# EAGLE design usb2ax_pro_main_v1.0 (EAGLE 7.6.0)
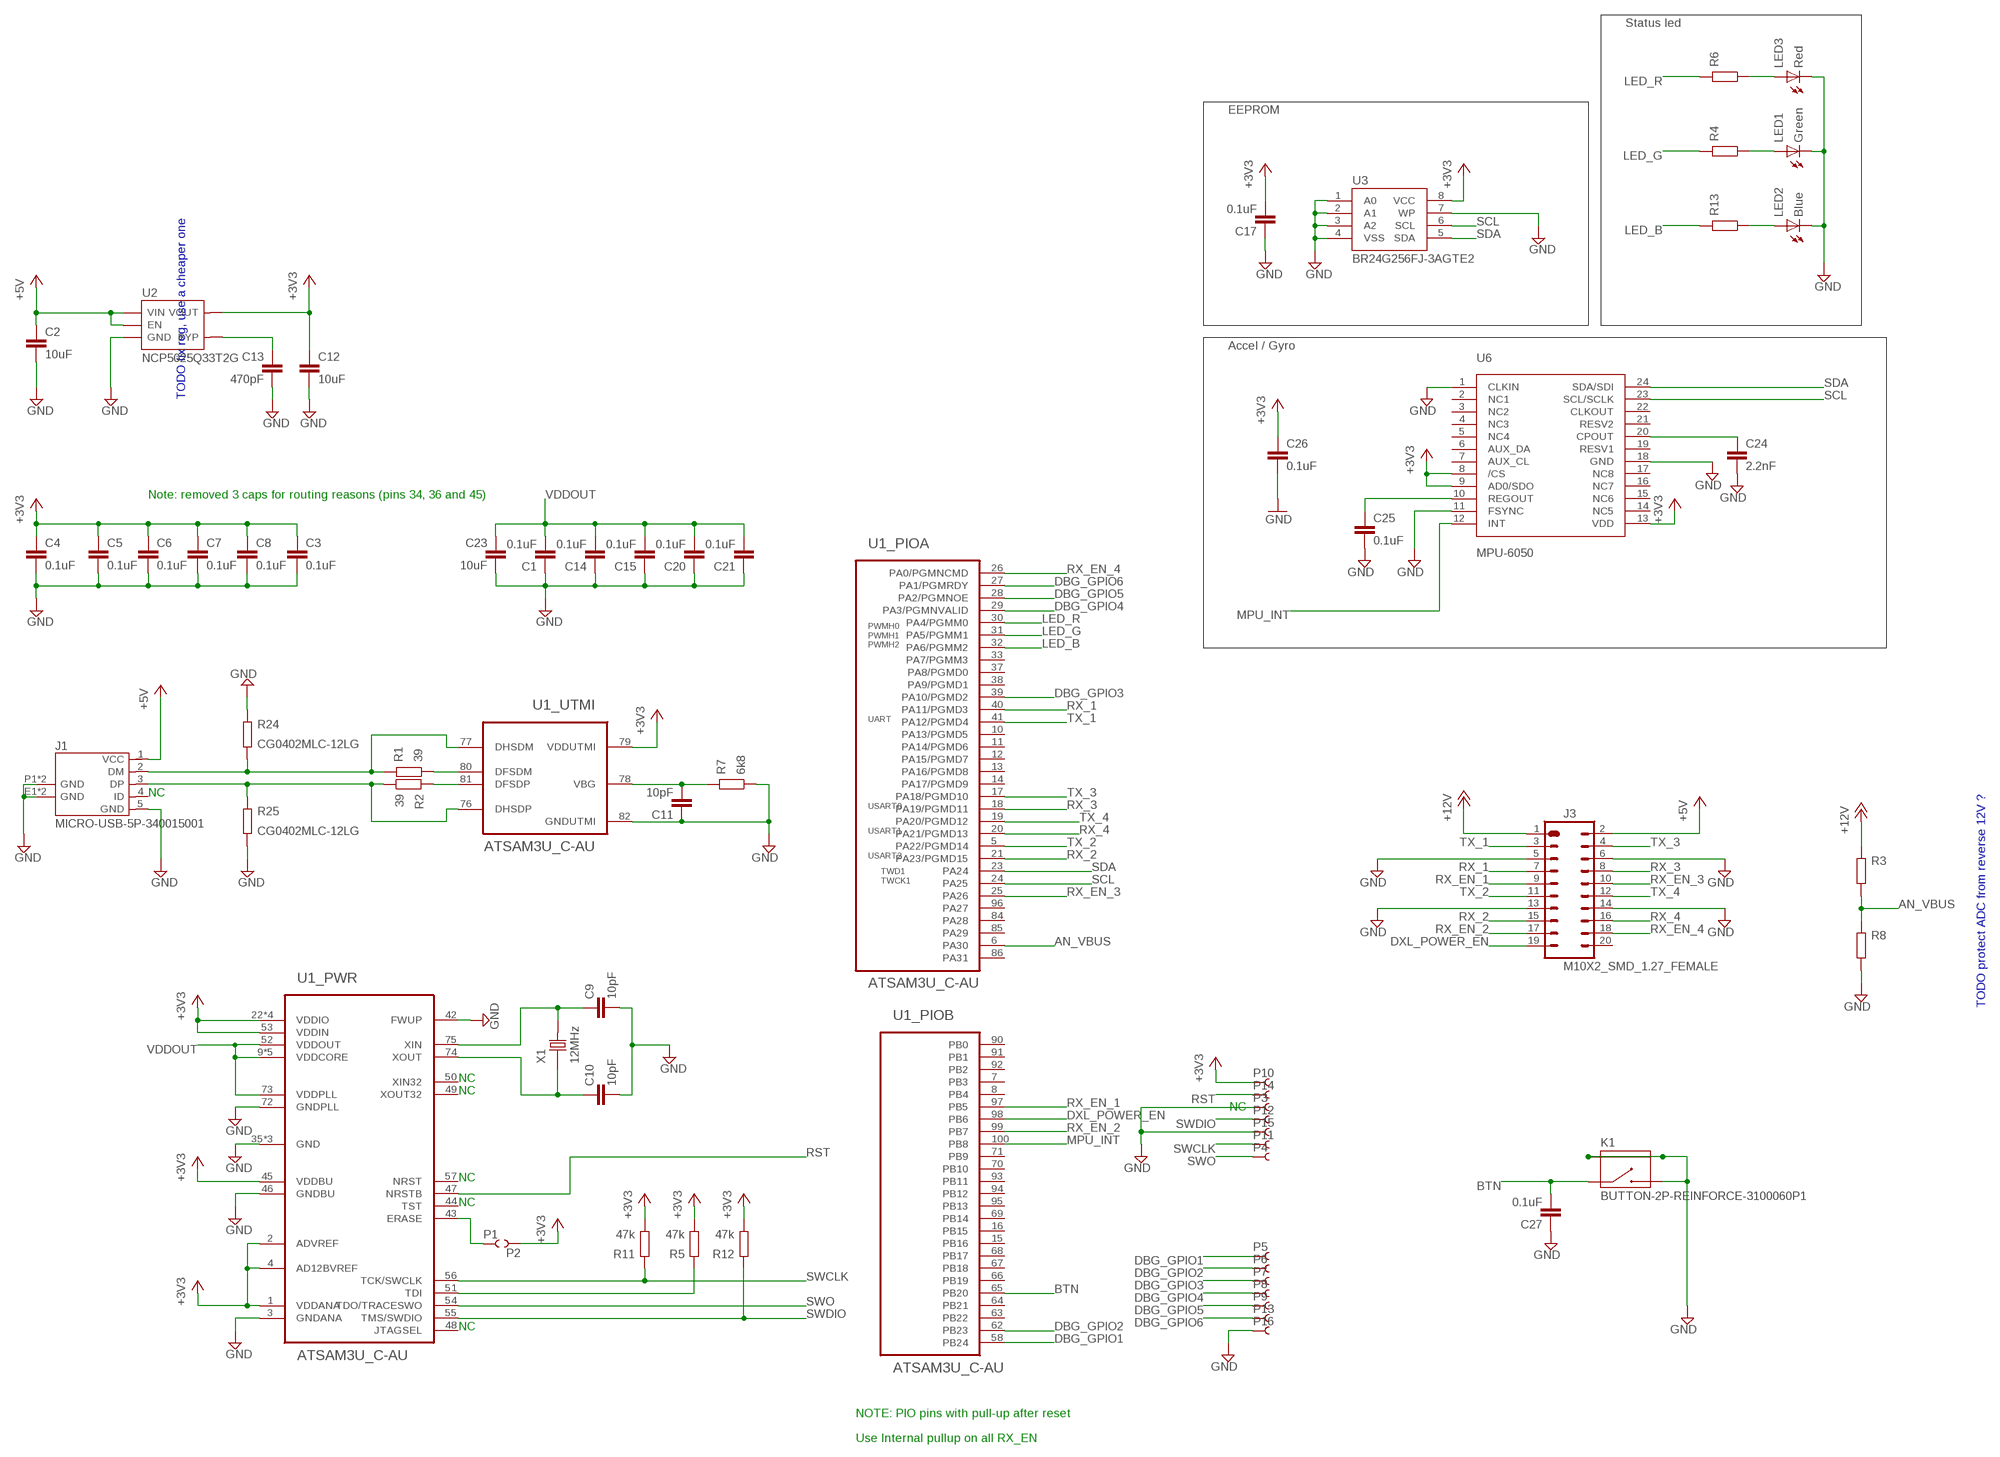
[diagram p0: schematic, sheet 1]

## Parts
C1  0.1uF  C0201  [0201_N]
C2  10uF  C0805  [0805_N]
C3  0.1uF  C0201  [0201_N]
C4  0.1uF  C0201  [0201_N]
C5  0.1uF  C0201  [0201_N]
C6  0.1uF  C0201  [0201_N]
C7  0.1uF  C0201  [0201_N]
C8  0.1uF  C0201  [0201_N]
C9  10pF  C0201  [0201_N]
C10  10pF  C0201  [0201_N]
C11  10pF  C0201  [0201_N]
C12  10uF  C0805  [0805_N]
C13  470pF  C0201  [0201_N]
C14  0.1uF  C0201  [0201_N]
C15  0.1uF  C0201  [0201_N]
C17  0.1uF  C0201  [0201_N]
C20  0.1uF  C0201  [0201_N]
C21  0.1uF  C0201  [0201_N]
C23  10uF  C0805  [0805_N]
C24  2.2nF  C0201  [0201_N]
C25  0.1uF  C0201  [0201_N]
C26  0.1uF  C0201  [0201_N]
C27  0.1uF  C0201  [0201_N]
J1  MICRO-USB-5P-340015001  [B-SMD-5P]
J3  M10X2_SMD_1.27_FEMALE  [2X10_SMD_1.27_FEMALE]
K1  BUTTON-2P-REINFORCE-3100060P1  [4P-SMD-7.0X3.5X3.5H-90D]
LED1  Green  LED0603  [D_0603_N]
LED2  Blue  LED0603  [D_0603_N]
LED3  Red  LED0603  [D_0603_N]
P1  PIN_SMD_2X2.5  [PIN_SMD_2X2.5]
P2  PIN_SMD_2X2.5  [PIN_SMD_2X2.5]
P3  PIN_SMD_0.8X1.6  [PIN_SMD_0.8X1.6]
P4  PIN_SMD_0.8X1.6  [PIN_SMD_0.8X1.6]
P5  PIN_SMD_1X2  [PIN_SMD_1X2]
P6  PIN_SMD_1X2  [PIN_SMD_1X2]
P7  PIN_SMD_1X2  [PIN_SMD_1X2]
P8  PIN_SMD_1X2  [PIN_SMD_1X2]
P9  PIN_SMD_1X2  [PIN_SMD_1X2]
P10  PIN_SMD_0.8X1.6  [PIN_SMD_0.8X1.6]
P11  PIN_SMD_0.8X1.6  [PIN_SMD_0.8X1.6]
P12  PIN_SMD_0.8X1.6  [PIN_SMD_0.8X1.6]
P13  PIN_SMD_1X2  [PIN_SMD_1X2]
P14  PIN_SMD_0.8X1.6  [PIN_SMD_0.8X1.6]
P15  PIN_SMD_0.8X1.6  [PIN_SMD_0.8X1.6]
P16  PIN_SMD_1X2  [PIN_SMD_1X2]
R1  39  R0201  [0201_N]
R2  39  R0201  [0201_N]
R3  R0201  [0201_N]
R4  R0201  [0201_N]
R5  47k  R0201  [0201_N]
R6  R0201  [0201_N]
R7  6k8  R0201  [0201_N]
R8  R0201  [0201_N]
R11  47k  R0201  [0201_N]
R12  47k  R0201  [0201_N]
R13  R0201  [0201_N]
R24  CG0402MLC-12LG  R0402  [0402_N]
R25  CG0402MLC-12LG  R0402  [0402_N]
U1  ATSAM3U_C-AU  [QFP50P1600X1600-100N]
U2  NCP5025Q33T2G  MIC5205-3.3YM5  [SC70-5]
U3  BR24G256FJ-3AGTE2  EEPROM-I2CSMD  [SO08]
U6  MPU-6050  MPU-6000  [QFN-24]
X1  12MHz  CRYSTAL-0500290P1  [2P-SMD-5.0X3.2]

## Nets
+3V3: C3.1 C4.1 C5.1 C6.1 C7.1 C8.1 C12.1 C17.2 C26.1 P2.PIN P10.PIN R5.1 R11.1 R12.1 U1.1(_PWR:VDDANA) U1.2(_PWR:ADVREF) U1.4(_PWR:AD12BVREF) U1.22(_PWR:VDDIO) U1.36(_PWR:VDDIO) U1.45(_PWR:VDDBU) U1.53(_PWR:VDDIN) U1.60(_PWR:VDDIO) U1.79(_UTMI:VDDUTMI) U1.88(_PWR:VDDIO) U2.5(VOUT) U3.8(VCC) U6.8(/CS) U6.9(AD0/SDO) U6.13(VDD)
+5V: C2.1 J1.1(VCC) J3.2 U2.1(VIN) U2.3(EN)
+12V: J3.1 R3.2
AN_VBUS: R3.1 R8.2 U1.6(_PIOA:PA30)
BTN: C27.2 K1.1 U1.65(_PIOB:PB20)
DBG_GPIO1: P5.P$1 U1.58(_PIOB:PB24)
DBG_GPIO2: P6.P$1 U1.62(_PIOB:PB23)
DBG_GPIO3: P7.P$1 U1.39(_PIOA:PA10/PGMD2)
DBG_GPIO4: P8.P$1 U1.29(_PIOA:PA3/PGMNVALID)
DBG_GPIO5: P9.P$1 U1.28(_PIOA:PA2/PGMNOE)
DBG_GPIO6: P13.P$1 U1.27(_PIOA:PA1/PGMRDY)
DXL_POWER_EN: J3.19 U1.98(_PIOB:PB6)
GND: C1.1 C2.2 C3.2 C4.2 C5.2 C6.2 C7.2 C8.2 C9.2 C10.2 C11.1 C12.2 C13.2 C14.1 C15.1 C17.1 C20.1 C21.1 C23.2 C24.2 C25.2 C26.2 C27.1 J1.5(GND) J1.E1(GND) J1.E2(GND) J1.P1(GND) J1.P2(GND) J3.5 J3.6 J3.13 J3.14 K1.2 K1.S1 K1.S2 LED1.C LED2.C LED3.C P3.PIN P15.PIN P16.P$1 R7.1 R8.1 R24.2 R25.1 U1.3(_PWR:GNDANA) U1.35(_PWR:GND) U1.42(_PWR:FWUP) U1.46(_PWR:GNDBU) U1.61(_PWR:GND) U1.72(_PWR:GNDPLL) U1.82(_UTMI:GNDUTMI) U1.89(_PWR:GND) U2.2(GND) U3.1(A0) U3.2(A1) U3.3(A2) U3.4(VSS) U3.7(WP) U6.1(CLKIN) U6.11(FSYNC) U6.18(GND)
LED_B: R13.2 U1.32(_PIOA:PA6/PGMM2)
LED_G: R4.2 U1.31(_PIOA:PA5/PGMM1)
LED_R: R6.2 U1.30(_PIOA:PA4/PGMM0)
MPU_INT: U1.100(_PIOB:PB8) U6.12(INT)
N$1: J1.2(DM) R1.2 R24.1 U1.77(_UTMI:DHSDM)
N$2: J1.3(DP) R2.1 R25.2 U1.76(_UTMI:DHSDP)
N$3: R2.2 U1.81(_UTMI:DFSDP)
N$4: R1.1 U1.80(_UTMI:DFSDM)
N$5: LED3.A R6.1
N$6: LED2.A R13.1
N$16: LED1.A R4.1
N$17: C9.1 U1.75(_PWR:XIN) X1.2
N$18: C10.1 U1.74(_PWR:XOUT) X1.1
N$19: P1.PIN U1.43(_PWR:ERASE)
N$20: C13.1 U2.4(BYP)
N$25: C11.2 R7.2 U1.78(_UTMI:VBG)
N$31: C25.1 U6.10(REGOUT)
N$33: C24.1 U6.20(CPOUT)
RST: P14.PIN U1.47(_PWR:NRSTB)
RX_1: J3.7 U1.40(_PIOA:PA11/PGMD3)
RX_2: J3.15 U1.21(_PIOA:PA23/PGMD15)
RX_3: J3.8 U1.18(_PIOA:PA19/PGMD11)
RX_4: J3.16 U1.20(_PIOA:PA21/PGMD13)
RX_EN_1: J3.9 U1.97(_PIOB:PB5)
RX_EN_2: J3.17 U1.99(_PIOB:PB7)
RX_EN_3: J3.10 U1.25(_PIOA:PA26)
RX_EN_4: J3.18 U1.26(_PIOA:PA0/PGMNCMD)
SCL: U1.24(_PIOA:PA25) U3.6(SCL) U6.23(SCL/SCLK)
SDA: U1.23(_PIOA:PA24) U3.5(SDA) U6.24(SDA/SDI)
SWCLK: P11.PIN R11.2 U1.56(_PWR:TCK/SWCLK)
SWDIO: P12.PIN R12.2 U1.55(_PWR:TMS/SWDIO)
SWO: P4.PIN U1.54(_PWR:TDO/TRACESWO)
TDI: R5.2 U1.51(_PWR:TDI)
TX_1: J3.3 U1.41(_PIOA:PA12/PGMD4)
TX_2: J3.11 U1.5(_PIOA:PA22/PGMD14)
TX_3: J3.4 U1.17(_PIOA:PA18/PGMD10)
TX_4: J3.12 U1.19(_PIOA:PA20/PGMD12)
VDDOUT: C1.2 C14.2 C15.2 C20.2 C21.2 C23.1 U1.9(_PWR:VDDCORE) U1.34(_PWR:VDDCORE) U1.52(_PWR:VDDOUT) U1.59(_PWR:VDDCORE) U1.73(_PWR:VDDPLL) U1.83(_PWR:VDDCORE) U1.87(_PWR:VDDCORE)
Unconnected: J1.4(ID) J3.20 U1.7(_PIOB:PB3) U1.8(_PIOB:PB4) U1.10(_PIOA:PA13/PGMD5) U1.11(_PIOA:PA14/PGMD6) U1.12(_PIOA:PA15/PGMD7) U1.13(_PIOA:PA16/PGMD8) U1.14(_PIOA:PA17/PGMD9) U1.15(_PIOB:PB16) U1.16(_PIOB:PB15) U1.33(_PIOA:PA7/PGMM3) U1.37(_PIOA:PA8/PGMD0) U1.38(_PIOA:PA9/PGMD1) U1.44(_PWR:TST) U1.48(_PWR:JTAGSEL) U1.49(_PWR:XOUT32) U1.50(_PWR:XIN32) U1.57(_PWR:NRST) U1.63(_PIOB:PB22) U1.64(_PIOB:PB21) U1.66(_PIOB:PB19) U1.67(_PIOB:PB18) U1.68(_PIOB:PB17) U1.69(_PIOB:PB14) U1.70(_PIOB:PB10) U1.71(_PIOB:PB9) U1.84(_PIOA:PA28) U1.85(_PIOA:PA29) U1.86(_PIOA:PA31) U1.90(_PIOB:PB0) U1.91(_PIOB:PB1) U1.92(_PIOB:PB2) U1.93(_PIOB:PB11) U1.94(_PIOB:PB12) U1.95(_PIOB:PB13) U1.96(_PIOA:PA27) U6.2(NC1) U6.3(NC2) U6.4(NC3) U6.5(NC4) U6.6(AUX_DA) U6.7(AUX_CL) U6.14(NC5) U6.15(NC6) U6.16(NC7) U6.17(NC8) U6.19(RESV1) U6.21(RESV2) U6.22(CLKOUT)

## Notes on the sheet
- Status led
- EEPROM
- Accel / Gyro
- TODO fix reg, use a cheaper one
- Note: removed 3 caps for routing reasons (pins 34, 36 and 45)
- PWMH0
  PWMH1
  PWMH2
- UART
- NC
- USART0
- USART1
- USART2
- TWD1
  TWCK1
- TODO protect ADC from reverse 12V ?
- NC
- NC
- NC
- NC
- NC
- NC
- NOTE: PIO pins with pull-up after reset
- Use Internal pullup on all RX_EN

## Library data of the parts
C1-C15 C17 C20 C21 C23-C27 = Xevelabs:C: Non-polarized Capacitor
J1 = OPL:MICRO-USB-5P: ST-USB-001E：MICRO USB B SMD R/A
J3 = Xevelabs:M10X2
K1 = OPL:BUTTON-2P-REINFORCE: TS-1188E http://www.best-dz.com/?thread-374-2.html SMD Button
LED1-LED3 = Xevelabs:LED: LED
P1-P16 = Xevelabs:PIN
R1-R8 R11-R13 R24 R25 = Xevelabs:R: Resistor
U1 = atsam3u:ATSAM3U_C
U2 = OPL:MIC5205-3.3YM5: The MIC5205 is an efficient linear voltage regulator with ultra-low-noise output, very low dropout voltage (typically 17mV at light loads and 165mV at 150mA), and very low ground current (600µA at 100mA output). The MIC5205 offers better than 1% initial accuracy. datasheet here: http://www.micrel.com/product-info/prod/5205.shtml
U3 = SparkFun-DigitalIC:EEPROM-I2C: I2C EEPROM chips, 24LC256 (and others)
U6 = mpu6000:MPU-6000: Invensense MPU-6000: 3-axis gyro, 3-axis accel & 9-axis MotionFusion The MPU-60X0 Motion Processing Unit (MPU?) is the world?s first motion processing solution with integrated 9-axis sensor fusion for handset and tablet applications, game controllers, motion pointer remote controls, and other consumer devices. The MPU-60X0 has an embedded 3-axis MEMS gyroscope, 3-axis MEMS accelerometer and Digital Motion Processor? (DMP) hardware accelerator engine with an auxiliary I 2 C port that interfaces to third party digital sensors, such as magnetometers. Interfacing with a 3-axis magnetometer delivers a complete 9-axis sensor fusion output to the MPU?s primary I 2 C or SPI port. (SPI is available on MPU-6000 only). This combines acceleration and rotational motion plus heading information into a single data stream for the application; DATASHEET: http://invensense.com/mems/gyro/documents/PS-MPU-6000A-00_v1.0.pdf; LINK: http://invensense.com/mems/gyro/mpu6000.html; MFGPN: MPU-6000
X1 = OPL:CRYSTAL*

## Board
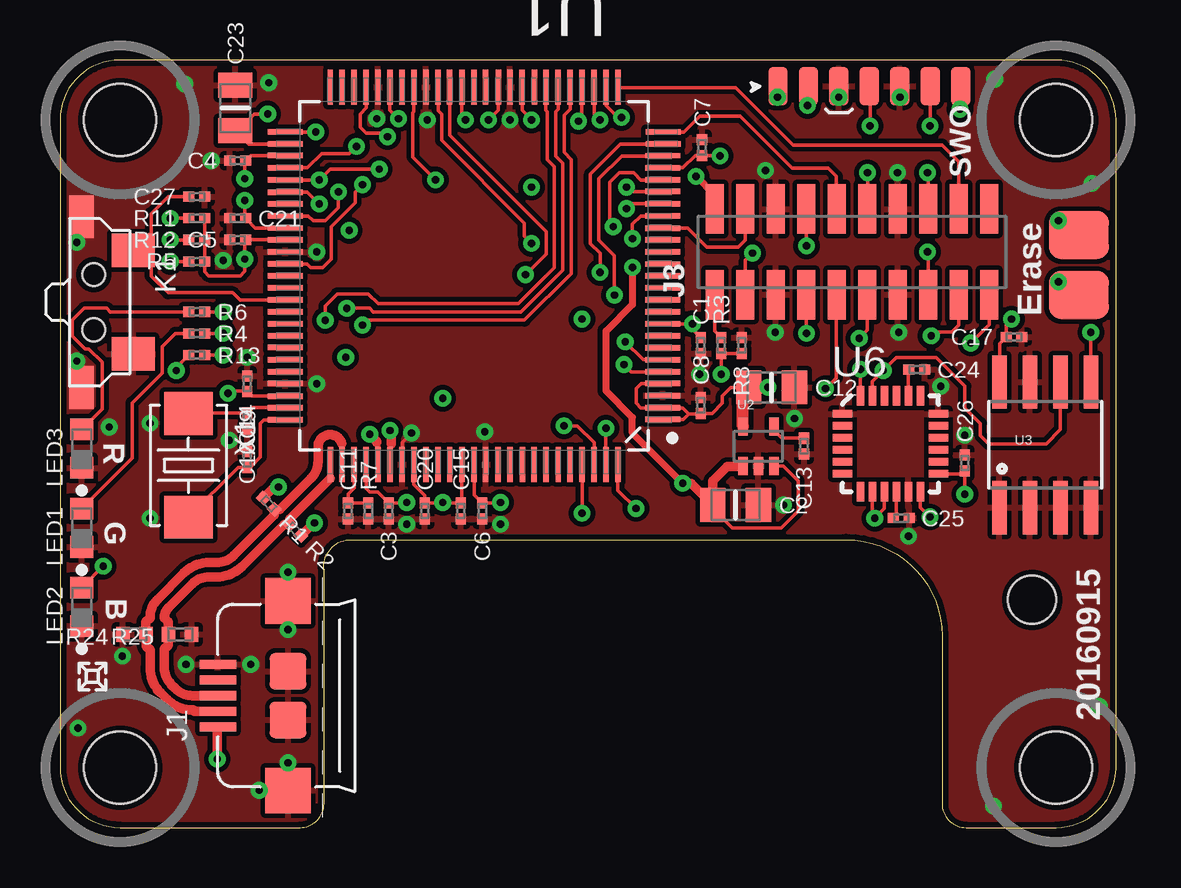
[diagram p1: board, top side]
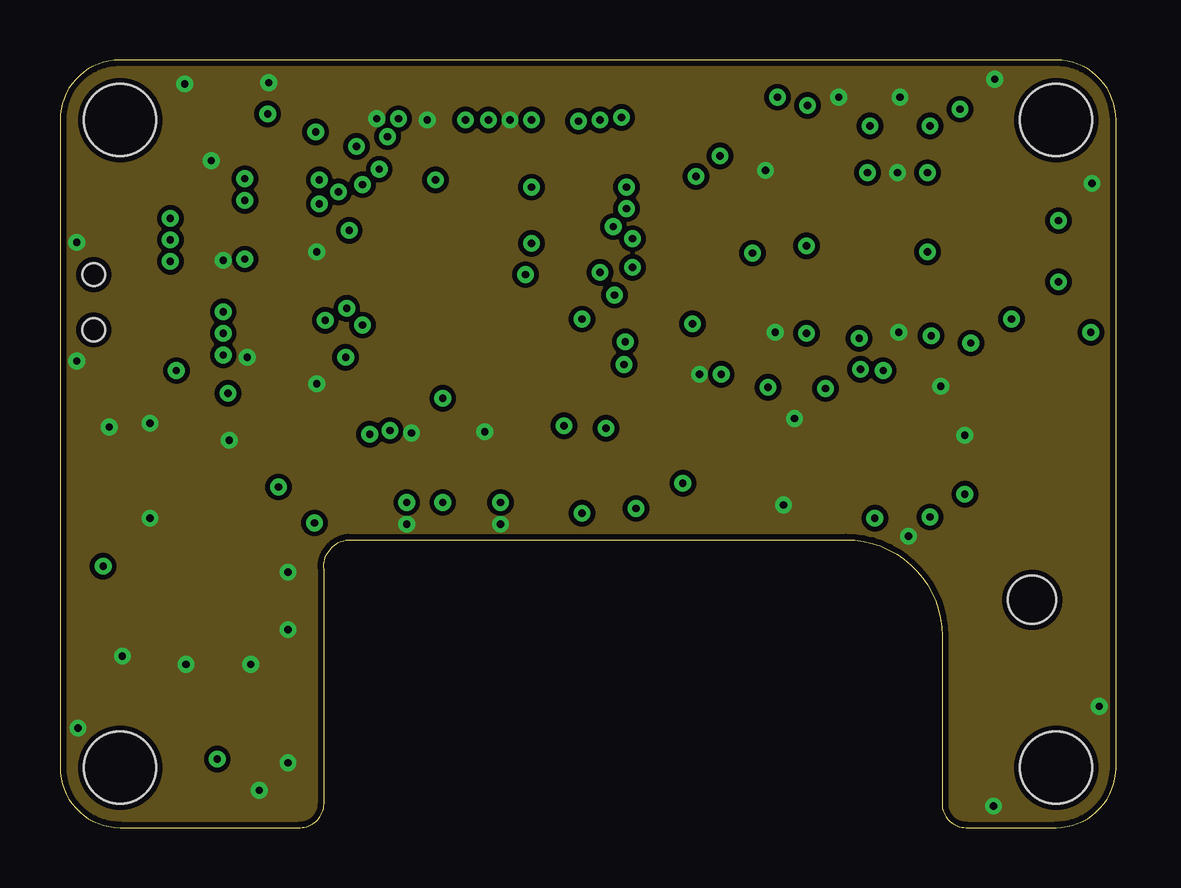
[diagram p2: board, inner layer Route2]
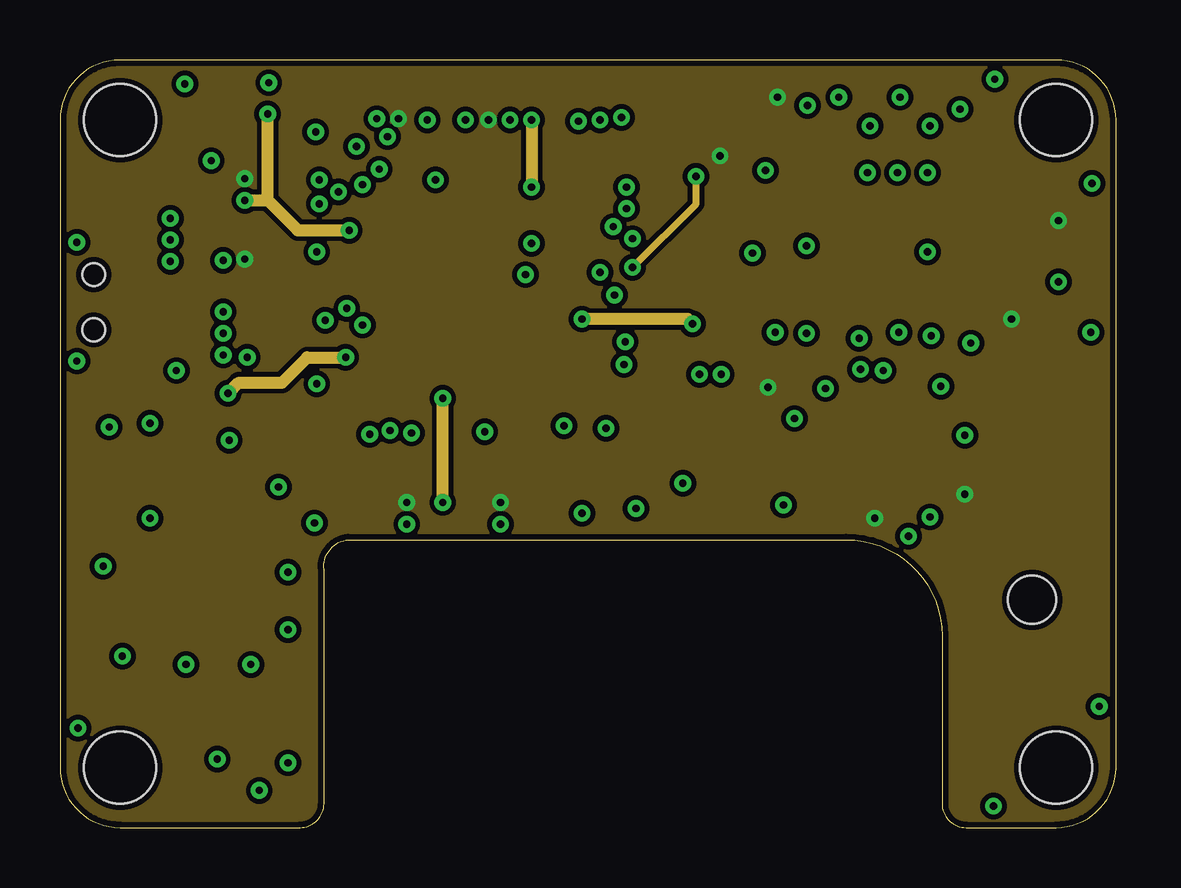
[diagram p3: board, inner layer Route3]
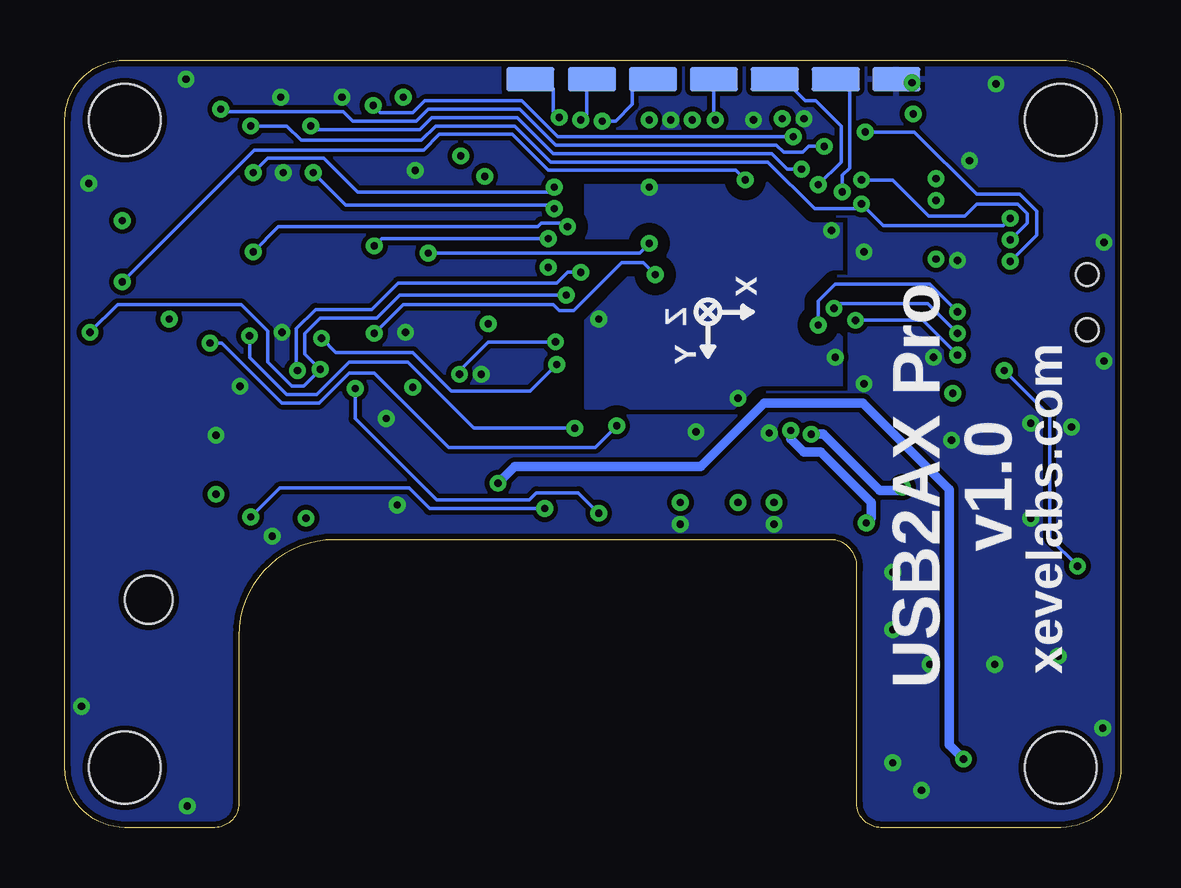
[diagram p4: board, bottom side, seen from below]

Size 44 x 32 mm. Coordinates in mm from the lower left corner, seen from the top.
Outline: 0,29.5 0,2.5 arc90 2.5,0 10,0 arc90 11,1 11,10.75 arc-90 12,12 32.75,12 arc-90 36.75,8 36.75,1 arc90 37.75,0 41.5,0 arc90 44,2.5 44,29.5 arc90 41.5,32 2.5,32 arc90 0,29.5
Copper layers (1*2*3*16): Top 0.035mm / dielectric 0.15mm / Route2 0.035mm / dielectric 1.1mm / Route3 0.035mm / dielectric 0.15mm / Bottom 0.035mm
Design rules "Xevelabs_6mil_4layers_eurocircuits": minimum track width 0.15mm, minimum drill 0.25mm, track to track 0.155mm, track to pad 0.155mm, pad to pad 0.155mm, via to via 0.155mm, smd to smd 0mil, copper to edge 0.25mm, drill to drill 0.25mm, minimum pad ring 0.15mm, minimum via ring 0.2mm, stop-mask expansion 0mil, vias tented up to drill 100mil, thermal gap 0.2mm
Holes 3 mm at 2.5,29.5 2.5,2.5 41.5,2.5 41.5,29.5
Holes 2 mm at 40.5,9.5

### Footprints (pad centres in the part's own frame; a part is rotated, then mirrored left to right if it is on the bottom)
0201_N = smd 0.46 x 0.42: 1 -0.33,0; 2 0.33,0
0805_N = smd 1.05 x 1.4: 1 -0.95,0; 2 0.95,0
B-SMD-5P = smd 0.38 x 1.52: 1 -1.3,2.921; 2 -0.65,2.921; 3 0,2.921; 4 0.65,2.921; 5 1.3,2.921 | smd 1.524 x 1.524: E1 -1.016,0; E2 1.016,0 | smd 1.9 x 1.9: P1 -3.95,0; P2 3.95,0
2X10_SMD_1.27_FEMALE = smd 2.05 x 0.75: 1 -1.79,5.715; 2 1.79,5.715; 3 -1.79,4.445; 4 1.79,4.445; 5 -1.79,3.175; 6 1.79,3.175; 7 -1.79,1.905; 8 1.79,1.905; 9 -1.79,0.635; 10 1.79,0.635; 11 -1.79,-0.635; 12 1.79,-0.635; 13 -1.79,-1.905; 14 1.79,-1.905; 15 -1.79,-3.175; 16 1.79,-3.175; 17 -1.79,-4.445; 18 1.79,-4.445; 19 -1.79,-5.715; 20 1.79,-5.715
4P-SMD-7.0X3.5X3.5H-90D = smd 1.397 x 1.778: 1 -2.159,1.651; 2 2.159,1.651 | smd 1.778 x 1.016: S1 -3.556,-0.508; S2 3.556,-0.508 | hole 0.95: -1.15,0; 1.15,0
D_0603_N = smd 0.9 x 0.95: A 0.8,0; C -0.8,0
PIN_SMD_2X2.5 = smd 2.5 x 2: PIN 0,0
PIN_SMD_0.8X1.6 = smd 1.6 x 0.8: PIN 0,0
PIN_SMD_1X2 = smd 2 x 1: P$1 0,0
0402_N = smd 0.57 x 0.62: 1 -0.48,0; 2 0.48,0
QFP50P1600X1600-100N = smd 1.473 x 0.229: 1 -7.867,5.988; 2 -7.867,5.505; 3 -7.867,4.997; 4 -7.867,4.489; 5 -7.867,4.006; 6 -7.867,3.498; 7 -7.867,2.99; 8 -7.867,2.508; 9 -7.867,2; 10 -7.867,1.492; 11 -7.867,1.009; 12 -7.867,0.501; 13 -7.867,-0.007; 14 -7.867,-0.489; 15 -7.867,-0.997; 16 -7.867,-1.505; 17 -7.867,-1.988; 18 -7.867,-2.496; 19 -7.867,-3.004; 20 -7.867,-3.512; 21 -7.867,-3.995; 22 -7.867,-4.503; 23 -7.867,-5.011; 24 -7.883,-5.507; 25 -7.883,-5.999; 51 7.867,-6.003; 52 7.867,-5.495; 53 7.867,-5.012; 54 7.867,-4.504; 55 7.867,-3.996; 56 7.867,-3.488; 57 7.867,-3.005; 58 7.867,-2.497; 59 7.867,-1.989; 60 7.867,-1.507; 61 7.867,-0.999; 62 7.867,-0.491; 63 7.867,-0.008; 64 7.867,0.5; 65 7.867,1.008; 66 7.867,1.49; 67 7.867,1.998; 68 7.867,2.506; 69 7.867,2.989; 70 7.867,3.497; 71 7.867,4.005; 72 7.867,4.488; 73 7.867,5.012; 74 7.867,5.495; 75 7.867,6.003 | smd 0.229 x 1.473: 26 -5.991,-7.867; 27 -5.508,-7.867; 28 -5,-7.867; 29 -4.492,-7.867; 30 -4.01,-7.867; 31 -3.502,-7.867; 32 -2.994,-7.867; 33 -2.511,-7.867; 34 -2.003,-7.867; 35 -1.495,-7.867; 36 -1.012,-7.867; 37 -0.488,-7.867; 38 -0.005,-7.867; 39 0.503,-7.867; 40 1.011,-7.867; 41 1.494,-7.867; 42 2.002,-7.867; 43 2.51,-7.867; 44 2.992,-7.867; 45 3.5,-7.867; 46 4.008,-7.867; 47 4.491,-7.867; 48 4.999,-7.867; 49 5.507,-7.867; 50 5.989,-7.867; 76 5.989,7.867; 77 5.506,7.867; 78 4.998,7.867; 79 4.49,7.867; 80 4.008,7.867; 81 3.5,7.867; 82 2.992,7.867; 83 2.509,7.867; 84 2.001,7.867; 85 1.493,7.867; 86 1.011,7.867; 87 0.503,7.867; 88 -0.005,7.867; 89 -0.488,7.867; 90 -0.996,7.867; 91 -1.504,7.867; 92 -2.012,7.867; 93 -2.495,7.867; 94 -3.003,7.867; 95 -3.511,7.867; 96 -3.993,7.867; 97 -4.501,7.867; 98 -5.009,7.867; 99 -5.492,7.867; 100 -6,7.867
SC70-5 = smd 0.4 x 0.75: 1 -0.65,-0.825; 2 0,-0.825; 3 0.65,-0.825; 4 0.65,0.825; 5 -0.65,0.825
SO08 = smd 0.61 x 2.21: 1 -1.905,-2.616; 2 -0.635,-2.616; 3 0.635,-2.616; 4 1.905,-2.616; 5 1.905,2.616; 6 0.635,2.616; 7 -0.635,2.616; 8 -1.905,2.616
QFN-24 = smd 0.8 x 0.3: 1 -2,1.25; 2 -2,0.75; 3 -2,0.25; 4 -2,-0.25; 5 -2,-0.75; 6 -2,-1.25; 13 2,-1.25; 14 2,-0.75; 15 2,-0.25; 16 2,0.25; 17 2,0.75; 18 2,1.25 | smd 0.3 x 0.8: 7 -1.25,-2; 8 -0.75,-2; 9 -0.25,-2; 10 0.25,-2; 11 0.75,-2; 12 1.25,-2; 19 1.25,2; 20 0.75,2; 21 0.25,2; 22 -0.25,2; 23 -0.75,2; 24 -1.25,2
2P-SMD-5.0X3.2 = smd 1.778 x 2.032: 1 -2.159,0; 2 2.159,0

### Placement (x,y rotation side)
C1  26.7,20.1 90 top
C2  28.15,13.45 0 top
C3  13.7,13.2 270 top
C4  7.4,27.8 180 top
C5  7.4,24.5 180 top
C6  17.6,13.2 270 top
C7  26.75,28.35 90 top
C8  26.7,17.6 90 top
C9  7.8,15.35 90 top
C10  7.8,16.95 270 top
C11  12,13.2 90 top
C12  29.65,18.35 0 top
C13  31,15.9 270 top
C14  7.8,18.5 270 top
C15  16.7,13.2 90 top
C17  39.75,20.45 180 top
C20  15.2,13.2 90 top
C21  7.4,25.4 0 top
C23  7.3,30 90 top
C24  35.7,19.1 0 top
C25  35.05,12.9 0 top
C26  37.7,15.2 90 top
C27  5.7,26.3 180 top
J1  9.5,5.5 90 top
J3  33,24 90 top
K1  1.4,21.9 270 top
LED1  0.9,12.5 90 top
LED2  0.9,9.2 90 top
LED3  0.9,15.8 90 top
P1  42.45,22.2 180 top
P2  42.45,24.7 180 top
P3  32.45,30.91 270 top
P4  37.53,30.91 90 top
P5  11.88,31.2 0 bottom
P6  14.41,31.2 0 bottom
P7  16.95,31.2 0 bottom
P8  19.5,31.2 0 bottom
P9  22.04,31.2 0 bottom
P10  29.91,30.91 90 top
P11  36.26,30.91 90 top
P12  33.72,30.91 90 top
P13  24.6,31.2 180 bottom
P14  31.18,30.91 90 top
P15  34.99,30.91 90 top
P16  9.35,31.2 180 bottom
R1  8.7,13.5 315 top
R2  9.8,12.4 315 top
R3  27.55,20.1 90 top
R4  5.7,20.6 0 top
R5  5.7,23.6 180 top
R6  5.7,21.5 0 top
R7  12.85,13.2 90 top
R8  28.4,20.1 270 top
R11  5.7,25.4 180 top
R12  5.7,24.5 180 top
R13  5.7,19.7 0 top
R24  3.1,8.05 180 top
R25  5,8.05 180 top
U1  17.25,23 180 top
U2  29.1,15.9 0 top
U3  41.05,15.95 0 top
U6  34.6,16 0 top
U$3  [XEVELABS_LOGO_S]  1.3,6.25 0 top
X1  5.35,15.1 270 top

### Tracks (layer width: path | path; a pad name or v marks a point on that pad's centre or on a via)
+3V3  (via drill 0.3)
  Top 0.15: U1.79 12.76,14.14 12.9,14 13.23,14 C3.1 14.43,13.53 v14.45,13.55 | U1.88 17.25,13.88 C6.1 18.33,13.53 v18.35,13.55 | v14.1,29.55 13.75,29.9 U1.45 | v17.85,29.5 18.26,29.91 U1.36 | U1.4 24.21,18.51 24,18.3 24,17.7 24.2,17.5 U1.2 25.95,17.5 26.2,17.25 | U1.1 25.96,17.01 26.2,17.25 | 26.2,17.25 26.68,17.25 C8.1 27.17,17.27 27.6,17.7 27.6,18 27.95,18.35 C12.1 | U1.53 7.94,28.01 C4.1 7.7,27.77 v7.7,27.05 | U1.60 C5.1 7.7,24.47 v7.7,23.7 7.7,23.2 7.5,23 6.2,23 6.03,23.17 R5.1 R12.1 R11.1 | P2.PIN 41.85,25.3 v41.6,25.3 | v29.9,30.45 v29.91,30.46 P10.PIN | U6.8 33.85,13 v33.95,12.9 34.35,13.3 U6.9 | U6.13 37.58,14.75 C26.1 v37.7,13.9 | U1.22 25.95,27.5 26.47,28.02 C7.1 | U3.8 39.15,19.02 39.15,20.18 C17.2 39.42,20.97 v39.65,21.2 | 27.03,28.02 C7.1 | v27.5,28 27.48,28.02 C7.1
  Top 0.5: U2.5 28.45,18.1 C12.1 v29.5,18.35
  pour Route3 (isolate 0.2): -2,33.1 46.4,33.1 46.4,-1.1 -2,-1.1
+5V  (via drill 0.3)
  Top 0.15: 29.77,15.07 U2.3 30.12,15.07 30.75,14.45 30.75,13.2 30.05,12.5 28,12.5 27.6,12.9 27.6,13.05 C2.1 | J3.2 27.29,26.36
  Top 0.3: 27.29,26.36 v26.5,27.15 | v23.85,23.35 23.85,21.8 22.75,20.7 22.75,18.2 23.85,17.1 23.85,16.45 v25.95,14.35
  Top 0.4: v6.55,2.85 6.55,4.17 J1.1 | U2.1 28.43,15.05 27.8,15.05 27.2,14.45 C2.1 26.3,14.35 v25.95,14.35
  Route3 0.3: v23.85,23.35 26.5,26 v26.5,27.15
  Bottom 0.4: v6.55,2.85 7.15,3.45 7.15,14.1 10.75,17.7 14.85,17.7 17.5,15.05 25.25,15.05 v25.95,14.35
+12V
  Top 0.15: J3.1 27.29,20.7 R3.2
AN_VBUS  (via drill 0.3)
  Top 0.15: U1.6 24.3,19.5 v23.55,20.25 | v27.55,18.9 R3.1 R8.2
  Bottom 0.15: v23.55,20.25 26.35,20.25 27.55,19.05 v27.55,18.9
BTN
  Top 0.15: C27.2 4.5,26.3 3.8,25.6 3.8,24.81 K1.1 3.8,23.31 3.8,23 4.5,22.3 7.2,22.3 7.51,21.99 U1.65
DBG_GPIO1  (via drill 0.3)
  Top 0.15: U1.58 10.35,25.5 10.55,25.3 11.05,25.3 11.6,25.85 v11.6,26.5
  Bottom 0.15: v11.6,26.5 11.6,27.2 11.3,27.5 11.3,30.8 11.47,30.8 P5.P$1
DBG_GPIO2  (via drill 0.3)
  Top 0.15: U1.62 10.31,23.49 10.45,23.35 10.95,23.35 11.3,23.7 11.3,25.05 12.3,26.05 12.3,26.5 v12.6,26.8
  Bottom 0.15: v12.6,26.8 11.65,27.75 11.65,29.25 12.7,30.3 13.15,30.3 14.05,31.2 P6.P$1
DBG_GPIO3  (via drill 0.3)
  Top 0.15: U1.39 16.75,29.65 v16.9,29.5
  Bottom 0.15: v16.9,29.5 16.95,29.55 P7.P$1
DBG_GPIO4  (via drill 0.3)
  Top 0.15: U1.29 21.74,29.59 v21.6,29.45
  Bottom 0.15: v21.6,29.45 21.05,29.45 20.35,30.15 20.35,30.85 19.84,30.85 P8.P$1
DBG_GPIO5  (via drill 0.3)
  Top 0.15: U1.28 22.25,29.75 v22.5,29.5
  Bottom 0.15: P9.P$1 22.25,30.98 22.25,29.75 v22.5,29.5
DBG_GPIO6  (via drill 0.3)
  Top 0.15: U1.27 22.76,30.09 23.25,29.6 v23.4,29.6
  Bottom 0.15: P13.P$1 24.5,31.1 23.95,31.1 23.65,30.8 23.65,29.85 v23.4,29.6
DXL_POWER_EN  (via drill 0.3)
  Top 0.15: J3.19 38.72,20.96 v37.95,20.2 | v21,16.75 21.55,16.75 22.25,16.05 22.25,15.14 U1.98
  Bottom 0.15: v37.95,20.2 37.45,20.2 34.95,17.7 33.4,17.7 32.15,18.95 31.1,18.95 28,15.85 21.9,15.85 v21,16.75
GND  (via drill 0.3)
  Top 0.15: v14.65,16.45 14.26,16.06 U1.82
  Bottom 0.15: P16.P$1 9.2,31.05 v8.7,31.05
  other vias: 10.7,24 13.2,29.55 15.3,29.5 18.75,29.5 26.65,18.9 17.7,16.5 10.7,18.5 14.45,12.65 18.35,12.65 7.05,16.15 3.75,16.85 3.75,12.9 6.8,23.65 6.3,27.8 0.7,19.45 0.7,24.4 2.05,16.7 7.8,19.6 5.25,6.8 2.6,7.15 7.95,6.8 9.5,10.65 9.5,2.7 9.5,8.25 8.3,1.55 32.45,30.45 35,30.45 30.15,13.45 30.6,17.05 36.7,18.4 35.35,12.15 37.7,16.35 38.9,0.9 0.75,4.15 5.2,31 38.95,31.2 43,26.85 29.4,27.4 29.8,20.65 34.95,20.65 34.9,27.3 43.3,5.05
  pour Route2 (isolate 0.2): -2,33.1 46.4,33.1 46.4,-1.1 -2,-1.1
  pour Bottom (isolate 0.2, rank 2): -1.9,33.7 46.5,33.7 46.5,-0.5 -1.9,-0.5
  pour Top (isolate 0.2): -1.85,33.4 46.55,33.4 46.55,-0.8 -1.85,-0.8
LED_B  (via drill 0.3)
  Top 0.15: R13.2 v6.8,19.7 | U1.32 20.24,29.91 20.3,29.85 20.3,27.85 20.6,27.55 20.6,23.35 19.1,21.85 13.25,21.85 12.85,22.25 11.55,22.25 11.05,21.75 v11.05,21.15
  Bottom 0.15: v6.8,19.7 8.25,21.15 v11.05,21.15
LED_G  (via drill 0.3)
  Top 0.15: U1.31 20.75,29.95 20.65,29.85 20.65,28 20.95,27.7 20.95,23.25 19.2,21.5 13.05,21.5 12.9,21.65 v11.95,21.65 | R4.2 v6.8,20.6
  Bottom 0.15: v6.8,20.6 8.05,21.85 11.75,21.85 v11.95,21.65
LED_R  (via drill 0.3)
  Top 0.15: U1.30 21.25,30.86 21.25,29.95 21,29.7 21,28.15 21.3,27.85 21.3,23.1 19.35,21.15 12.8,21.15 v12.6,20.95 | R6.2 v6.8,21.5
  Bottom 0.15: v6.8,21.5 7.95,22.65 11.9,22.65 12.6,21.95 v12.6,20.95
MPU_INT  (via drill 0.3)
  Top 0.15: U1.100 23.25,14.05 v24,13.3 | U6.12 35.85,13.35 v36.25,12.95
  Bottom 0.15: v24,13.3 28.8,13.3 29.65,14.15 35.05,14.15 v36.25,12.95
N$1
  Top 0.2: U1.77 11.74,16.01
  Top 0.4: J1.2 5.6,4.85 5.55,4.9 5.52,4.9 arc-45 4.46,5.34 4.19,5.61 arc-45 3.75,6.67 3.75,7.4 3.6,7.55 3.6,8.03 R24.1 3.58,8.58 3.75,8.75 arc-45 4.07,9.52 5.16,10.61 arc-45 6.22,11.05 6.54,11.05 arc45 7.24,11.34 8.93,13.03 R1.2 9.17,13.27 10.46,14.56 arc45 10.75,15.26 10.75,15.95 arc-156 11.74,16.01
N$2
  Top 0.2: U1.76 11.26,14.56
  Top 0.4: J1.3 5.51,5.5 arc-45 4.81,5.79 4.64,5.96 arc-45 4.35,6.66 4.35,7.45 4.5,7.6 4.5,8.03 R25.2 4.52,8.58 4.35,8.75 arc-45 4.53,9.18 5.51,10.16 arc-45 6.21,10.45 6.53,10.45 arc45 7.59,10.89 9.33,12.63 R2.1 9.57,12.87 11.26,14.56
N$3  (via drill 0.3)
  Top 0.2: 13.8,16 13.75,15.95 U1.81
  Top 0.4: R2.2 10.57,12.7 v10.6,12.7 | v13.75,16.55 13.8,16.5 13.8,16
  Bottom 0.4: v10.6,12.7 10.4,12.9 10.4,13.55 12.5,15.65 13.2,15.65 13.75,16.2 v13.75,16.55
N$4  (via drill 0.3)
  Top 0.2: 13.2,16.05 13.24,16.01 U1.80
  Top 0.4: R1.1 8.93,14.2 v9.1,14.2 | v12.9,16.4 13.2,16.1 13.2,16.05
  Bottom 0.4: v9.1,14.2 9.25,14.05 10.05,14.05 12.4,16.4 v12.9,16.4
N$5
  Top 0.15: R6.1 2.1,21.5 1.95,21.65 1,21.65 0.5,21.15 0.5,20.5 1.05,19.95 1.2,19.95 1.75,19.4 1.75,17.45 LED3.A 0.55,16.95
N$6  (via drill 0.3)
  Top 0.15: LED2.A v1.8,10.9 | v4.85,19.05 4.85,19.18 R13.1
  Bottom 0.15: v1.8,10.9 2.95,12.05 2.95,17.15 v4.85,19.05
N$16
  Top 0.15: R4.1 4.8,20.6 4.25,20.05 4.25,18.95 3,17.7 3,15.4 LED1.A
N$17
  Top 0.15: U1.75 8.5,17 8.35,16.85 8.35,15.45 7.92,15.02 C9.1 7.43,15.02 X1.2
N$18
  Top 0.15: U1.74 8.03,17.5 C10.1 5.37,17.28 X1.1
N$19  (via drill 0.3)
  Top 0.15: v15.65,27 14.7,27.95 14.7,29.8 14.74,29.84 U1.43 | P1.PIN 42.15,22.2 v41.6,22.75
  Bottom 0.15: v15.65,27 16.05,27.4 23.85,27.4 25.35,28.9 28.4,28.9 29.05,28.25 36.1,28.25 v41.6,22.75
N$20
  Top 0.15: U2.4 29.75,16.55 30.07,16.23 C13.1
N$25
  Top 0.15: R7.2 C11.2 12,13.9 12.25,14.15 U1.78
N$31
  Top 0.15: U6.10 34.85,13.03 C25.1
N$33
  Top 0.15: U6.20 35.35,19.08 C24.1
RST  (via drill 0.3)
  Top 0.15: U1.47 12.76,30.01 12.5,29.75 12.5,29.2 12.75,28.95 13.5,28.95 v13.65,28.8 | v31.15,30.1 31.15,30.88 P14.PIN
  Bottom 0.15: v31.15,30.1 30.85,29.8 29.5,29.8 29,30.3 24.95,30.3 23.45,28.8 v13.65,28.8
RX_1  (via drill 0.3)
  Top 0.15: J3.7 v31.09,20.61 v31.1,20.6 | v19.4,23.05 20.25,23.9 20.25,24.85 16.24,28.86 U1.40
  Bottom 0.15: v31.1,20.6 29.9,21.8 23.65,21.8 23.4,21.55 22.8,21.55 20.8,23.55 19.9,23.55 v19.4,23.05
RX_2  (via drill 0.3)
  Top 0.15: U1.21 24.2,27 23.9,27.3 23.3,27.3 22.9,26.9 22.9,25.2 v23.05,25.05 | J3.15 36.17,23.98 v36.15,24
  Bottom 0.15: v36.15,24 35.1,25.05 24.3,25.05 24.15,25.2 23.2,25.2 v23.05,25.05
RX_3  (via drill 0.3)
  Top 0.15: 24.25,25.5 U1.18 24.2,25.5 23.85,25.15 v23.85,24.55 | v31.1,24.25 J3.8
  Bottom 0.15: v31.1,24.25 30.8,24.55 v23.85,24.55
RX_4  (via drill 0.3)
  Top 0.15: J3.16 36.17,27.27 v36.15,27.3 | v23.6,26.7 23.79,26.51 U1.20
  Bottom 0.15: v23.6,26.7 23.8,26.5 31.8,26.5 33.2,27.9 35.55,27.9 v36.15,27.3
RX_EN_1  (via drill 0.3)
  Top 0.15: J3.9 32.35,22.2 32.35,18.75 v31.9,18.3 | v21.75,13.1 U1.97
  Bottom 0.15: v31.9,18.3 31.9,17.05 28.5,13.65 24.65,13.65 24.35,13.95 22.6,13.95 v21.75,13.1
RX_EN_2  (via drill 0.3)
  Top 0.15: J3.17 37.45,20.95 37.15,20.65 36.45,20.65 v36.3,20.5 | v22.75,16.65 v22.74,16.64 U1.99
  Bottom 0.15: v36.3,20.5 36.3,19.6 34.75,18.05 33.5,18.05 32.15,19.4 29.7,19.4 26.95,16.65 v22.75,16.65
RX_EN_3
  Top 0.15: J3.10 32.35,25.8 32.35,27.15 32,27.5 30.5,27.5 28.35,29.65 26.65,29.65 26,29 U1.25
RX_EN_4
  Top 0.15: J3.18 37.45,27.75 36.75,28.45 30.55,28.45 28.15,30.85 23.26,30.85 U1.26
SCL  (via drill 0.3)
  Top 0.15: U6.23 33.85,18.6 v34.3,19.05 34.85,19.6 36.5,19.6 37.7,18.4 37.7,17.5 38.35,16.85 38.35,16.35 38.7,16 41.1,16 41.69,16.59 U3.6 | U1.24 23.35,28.5 22.1,27.25 22.1,24.35 22.5,23.95 v22.5,23.15
  Bottom 0.15: v34.3,19.05 34.35,19.1 34.35,20.8 33.55,21.6 31.2,21.6 30.1,22.7 23.5,22.7 23.05,23.15 v22.5,23.15
SDA  (via drill 0.3)
  Top 0.15: U6.24 v33.35,19.1 | U1.23 25.11,28 23.4,28 22.45,27.05 22.45,24.5 23.1,23.85 v23.1,22.2 | v42.95,20.65 42.95,19.02 U3.5
  Bottom 0.15: v42.95,20.65 41.8,21.8 36.65,21.8 35.55,20.7 35.55,19.4 34.55,18.4 34.05,18.4 v33.35,19.1 34,19.75 34,20.6 33.35,21.25 31,21.25 30.05,22.2 v23.1,22.2
SWCLK  (via drill 0.3)
  Top 0.15: U1.56 10.31,26.49 v10.8,26 | v4.6,25.4 R11.2 | v36.25,29.25 P11.PIN
  Bottom 0.15: v4.6,25.4 4.9,25.1 9.9,25.1 v10.8,26 11,25.8 12.75,25.8 14.7,27.75 23.75,27.75 25.25,29.25 28.55,29.25 29.15,28.65 34.15,28.65 34.75,29.25 v36.25,29.25
SWDIO  (via drill 0.3)
  Top 0.15: R12.2 v4.6,24.5 | v10.8,27 U1.55 | v10.8,27 | v33.75,29.25 33.75,30.88 P12.PIN | v13.3,27.45 11.25,27.45 v10.8,27
  Bottom 0.15: v4.6,24.5 3.9,25.2 3.9,25.6 4.3,26 6,26 6.5,25.5 8,25.5 9.5,27 v10.8,27 | v13.3,27.45 13.9,27.45 14.55,28.1 23.65,28.1 25.15,29.6 28.7,29.6 29.2,29.1 33.6,29.1 v33.75,29.25
SWO  (via drill 0.3)
  Top 0.15: U1.54 10.3,27.5 10.9,28.1 12.05,28.1 v12.35,28.4 | v37.5,29.95 37.5,30.88 P4.PIN
  Bottom 0.15: v12.35,28.4 13,28.4 13.25,28.15 14.05,28.15 14.35,28.45 23.55,28.45 25.05,29.95 28.85,29.95 29.35,29.45 32,29.45 32.4,29.85 37.4,29.85 v37.5,29.95
TDI  (via drill 0.3)
  Top 0.15: R5.2 v4.6,23.6 | v10.65,29 U1.51
  Bottom 0.15: v4.6,23.6 3.5,24.7 3.5,25.7 4.2,26.4 6,26.4 8.6,29 v10.65,29
TX_1  (via drill 0.3)
  Top 0.15: J3.3 28.55,23.66 v28.85,23.95 | U1.41 15.76,29.89 15.9,29.75 15.9,28.65 19.35,25.2 19.35,24.65 v19.65,24.35
  Bottom 0.15: v19.65,24.35 20.05,23.95 v28.85,23.95
TX_2  (via drill 0.3)
  Top 0.15: U1.5 23.81,18.99 v23.5,19.3 | J3.11 33.63,20.73 v33.3,20.4
  Bottom 0.15: v33.3,20.4 32.7,19.8 29.5,19.8 27.9,18.2 24.6,18.2 v23.5,19.3
TX_3
  Top 0.15: U1.17 26.16,24.99 26.95,24.2 28.25,24.2 28.55,24.5 J3.4
TX_4  (via drill 0.3)
  Top 0.15: v33.65,27.3 33.65,25.8 J3.12 | v23.6,25.8 23.8,26 U1.19
  Bottom 0.15: v33.65,27.3 32.3,25.95 23.75,25.95 v23.6,25.8
VDDOUT  (via drill 0.3)
  Top 0.15: U1.87 16.75,13.58 C15.2 15.97,13.53 v15.95,13.55 15.93,13.53 C20.2 15.2,13.85 14.74,14.31 U1.83 | v19.65,29.5 19.25,29.9 U1.34 | U1.9 v26.35,21 26.35,20.78 C1.2 | U1.9 | U1.73 7.98,17.99 C14.2 7.77,18.2 7.1,18.2 v7,18.1 | U1.59 8.14,24.99 C21.2 7.7,25.43 v7.7,26.15 | U1.52 7.86,28.5 C23.1 7.4,29.05 8.1,29.75 v8.65,29.75
  Route3 0.5: v15.95,13.55 v15.95,17.9 | v26.35,21 26.15,21.2 v21.75,21.2 | v7,18.1 7.45,18.55 9.25,18.55 10.3,19.6 v11.9,19.6 | v19.65,29.5 v19.65,26.7 | v7.7,26.15 8.65,26.15 | 8.65,26.15 v8.65,29.75 | 8.65,26.15 9.9,24.9 v12.05,24.9
  pour Bottom (isolate 0.5): 11.65,28.15 11.65,17.5 22.3,17.5 22.3,28.2

### Text on the board
tPlace: SWO | Erase | R | G | B | 20160915
bPlace: X | Z | Y | USB2AX Pro / v1.0 | xevelabs.com